# EAGLE schematic reflow (EAGLE 7.1.0)
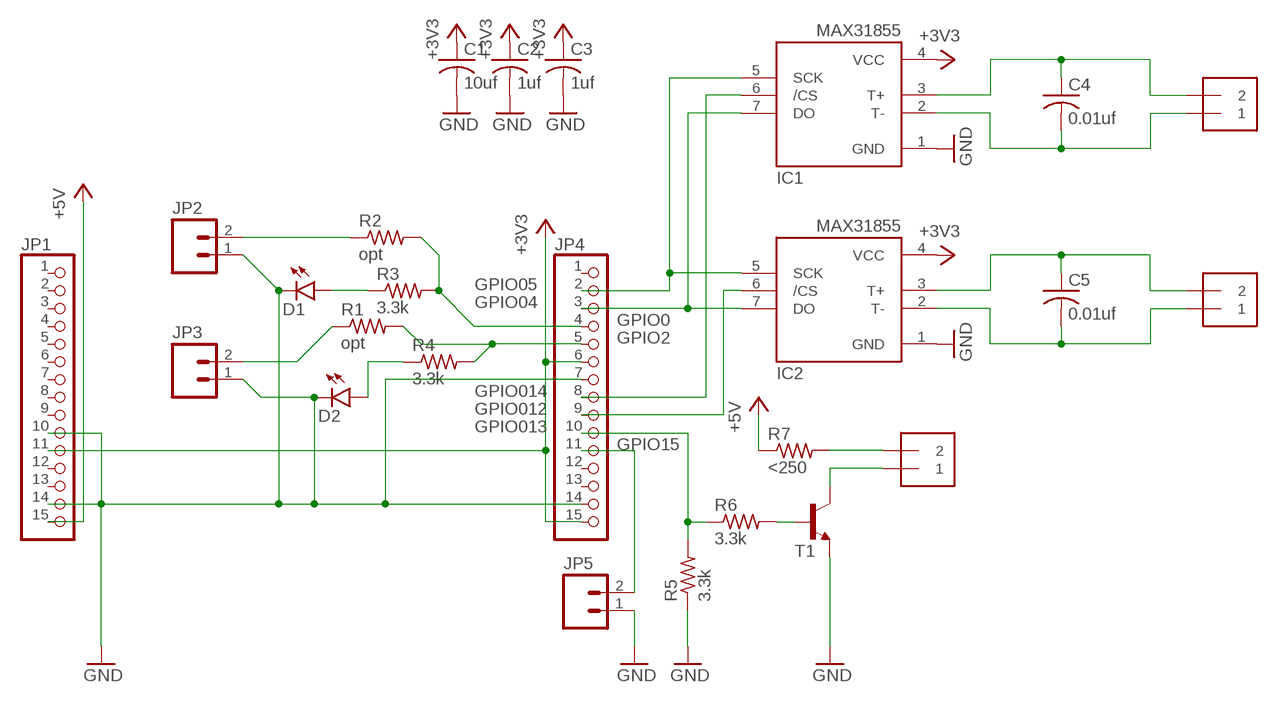
[diagram p0: schematic, sheet 1]

## Parts
C1  10uf  C-USC0603  [C0603]
C2  1uf  C-USC0603  [C0603]
C3  1uf  C-USC0603  [C0603]
C4  0.01uf  C-USC0603  [C0603]
C5  0.01uf  C-USC0603  [C0603]
D1  LED0603  [LED-0603]
D2  LED0603  [LED-0603]
IC1  MAX31855  MAX6675  [SO08]
IC2  MAX31855  MAX6675  [SO08]
J1  1X2-3.5MM  [1X2-3.5MM]
J2  1X2-3.5MM  [1X2-3.5MM]
J3  1X2-3.5MM  [1X2-3.5MM]
JP1  PINHD-1X15  [1X15]
JP2  M02PTH  [1X02]
JP3  M02PTH  [1X02]
JP4  PINHD-1X15  [1X15]
JP5  M02PTH  [1X02]
R1  opt  R-US_R0603  [R0603]
R2  opt  R-US_R0603  [R0603]
R3  3.3k  R-US_R0603  [R0603]
R4  3.3k  R-US_R0603  [R0603]
R5  3.3k  R-US_R0603  [R0603]
R6  3.3k  R-US_R0603  [R0603]
R7  <250  R-US_R0603  [R0603]
T1  MMBT3904LT1-NPN-SOT23-BEC  [SOT23-BEC]

## Nets
+3V3: C1.1 C2.1 C3.1 IC1.4(VCC) IC2.4(VCC) JP1.11 JP4.6 JP4.15
+5V: JP1.15 R7.1
GND: C1.2 C2.2 C3.2 D1.C D2.C IC1.1(GND) IC2.1(GND) JP1.10 JP1.14 JP2.1 JP3.1 JP4.7 JP4.14 JP5.1 R5.1 T1.E
N$1: C5.2 IC2.2(T-) J3.1
N$2: C4.2 IC1.2(T-) J2.1
N$3: C4.1 IC1.3(T+) J2.2
N$4: IC1.5(SCK) IC2.5(SCK) JP4.2
N$5: C5.1 IC2.3(T+) J3.2
N$6: IC1.7(DO) IC2.7(DO) JP4.3
N$7: IC1.6(/CS) JP4.8
N$8: IC2.6(/CS) JP4.9
N$9: J1.2 R7.2
N$10: J1.1 T1.C
N$11: JP4.10 R5.2 R6.1
N$12: JP2.2 R2.1
N$13: D2.A R4.1
N$14: D1.A R3.1
N$15: JP3.2 R1.1
N$16: JP4.11 JP5.2
N$19: JP4.4 R2.2 R3.2
N$20: JP4.5 R1.2 R4.2
N$27: R6.2 T1.B
Unconnected: JP1.1 JP1.2 JP1.3 JP1.4 JP1.5 JP1.6 JP1.7 JP1.8 JP1.9 JP1.12 JP1.13 JP4.1 JP4.12 JP4.13

## Notes on the sheet
- GPIO05
- GPIO04
- GPIO0
- GPIO2
- GPIO014
- GPIO012
- GPIO013
- GPIO15

## Library data of the parts
C1-C5 = resistor:C-US: CAPACITOR, American symbol
D1 D2 = SparkFun-LED:LED: LEDs Standard schematic elements and footprints for 5mm, 3mm, 1206, and 0603 sized LEDs. 5mm - Spark Fun Electronics SKU : COM-00529 (and others)
IC1 IC2 = adafruit:MAX6675
J1-J3 = adafruit:1X2: 3.5mm Terminal block http://www.ladyada.net/library/pcb/eaglelibrary.html
JP1 JP4 = pinhead:PINHD-1X15: PIN HEADER
JP2 JP3 JP5 = SparkFun-Connectors:M02: Standard 2-pin 0.1" header. Use with - straight break away headers ( PRT-00116) - right angle break away headers (PRT-00553) - swiss pins (PRT-00743) - machine pins (PRT-00117) - female headers (PRT-00115) Molex polarized connector foot print use with: PRT-08233 with associated crimp pins and housings. 2.54_SCREWTERM for use with PRT-10571. 3.5mm Screw Terminal footprints for PRT-08084 5mm Screw Terminal footprints for use with PRT-08432
R1-R7 = resistor:R-US_: RESISTOR, American symbol
T1 = transistor-neu-to92:*-NPN-: NPN Transistror; MPN: MMBT2222A

## Net classes
0 default: width 0.305 mm, clearance 0.356 mm